# Altium schematic sheet LDO_Reg.SchDoc
size A4; SheetNumber: 1; SheetTotal: 1
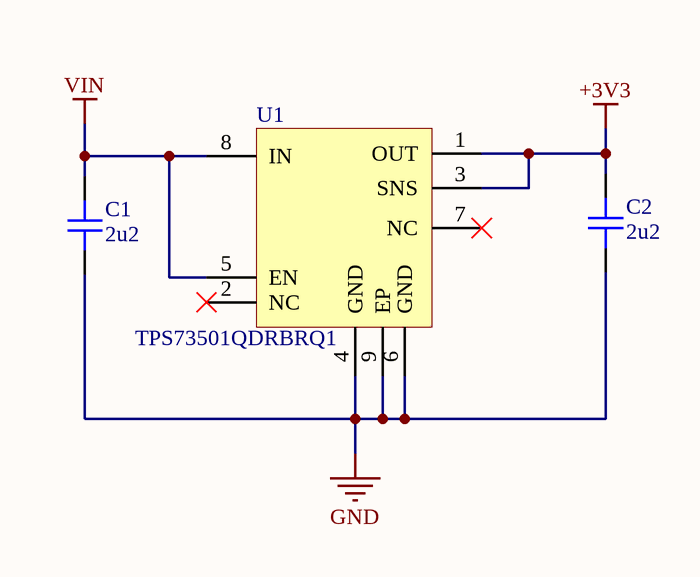
[diagram p0: LDO_Reg.SchDoc]

## Parts
C1  2u2  [CAP_0402]
C2  2u2  [CAP_0402]
U1  TPS73501QDRBRQ1  [VSON-8]

## Nets
+3V3: C2.2 U1.1(OUT) U1.3(SNS)
GND: C1.1 C2.1 U1.4(GND) U1.6(GND) U1.9(EP)
VIN: C1.2 U1.5(EN) U1.8(IN)

Not connected (* = marked no-connect by the designer): U1 2(NC)* 7(NC)*

## Library data of the parts
C1 C2 = CAP_0402_16V: Capacitor SMD 0402 16V
U1 = TPS73501QDRBRQ1: LDO Regulator Pos 1.25V to 6V 0.5A Automotive 8-Pin VSON EP T/R; Manufacturer: Texas Instruments; Output Current: 500mA; Dropout Voltage: 280mV; Number of Regulators: 1; Min Current Limit: 800mA; Max Input Voltage: 6.5V; Output Type: Adjustable; Supplier 1: Digi-Key; Manufacturer Part Number: TPS73501QDRBRQ1; RoHS: Yes; Category: Voltage Regulators - Linear; Stock 1: 879; Pricing 1: 1=1,87, 10=1,679, 25=1,5836, 100=1,3492, 250=1,26688, 500=1,10854, 1000=0,9185 (USD); Mount: Surface Mount; Case/Package: SON; Number of Pins: 8; Weight: 0.002677oz; Min Operating Temperature: -40°C; Max Operating Temperature: 125°C; Packaging: Tape and Reel; Output Voltage: 6V; Number of Outputs: 1; Package Quantity: 3000; Series: Automotive, AEC-Q100; Lead Free: Lead Free; RoHS Compliant: Yes; ComponentLink1URL: http://www.ti.com/lit/ds/symlink/tps735-q1.pdf?src-supplier=Digi-Key; ComponentLink1Description: http://www.ti.com/lit/ds/symlink/tps735-q1.pdf?src-supplier=Digi-Key; ComponentLink2URL: http://www.ti.com/general/docs/suppproductinfo.tsp?distId=10&amp;gotoUrl=http%3A%2F%2Fwww.ti.com%2Flit%2Fgpn%2Ftps735-q1&src-supplier=Digi-Key; ComponentLink2Description: http://www.ti.com/general/docs/suppproductinfo.tsp?distId=10&amp;gotoUrl=http%3A%2F%2Fwww.ti.com%2Flit%2Fgpn%2Ftps735-q1&src-supplier=Digi-Key; ComponentLink3URL: http://www.ti.com/lit/gpn/tps735-q1?src-supplier=Mouser; ComponentLink3Description: http://www.ti.com/lit/gpn/tps735-q1?src-supplier=Mouser; ComponentLink4URL: http://www.ti.com/general/docs/lit/getliterature.tsp?genericPartNumber=TPS735-Q1&&fileType=pdf&src-supplier=Avnet; ComponentLink4Description: http://www.ti.com/general/docs/lit/getliterature.tsp?genericPartNumber=TPS735-Q1&&fileType=pdf&src-supplier=Avnet; Supplier Part Number 1: 296-40952-1-ND